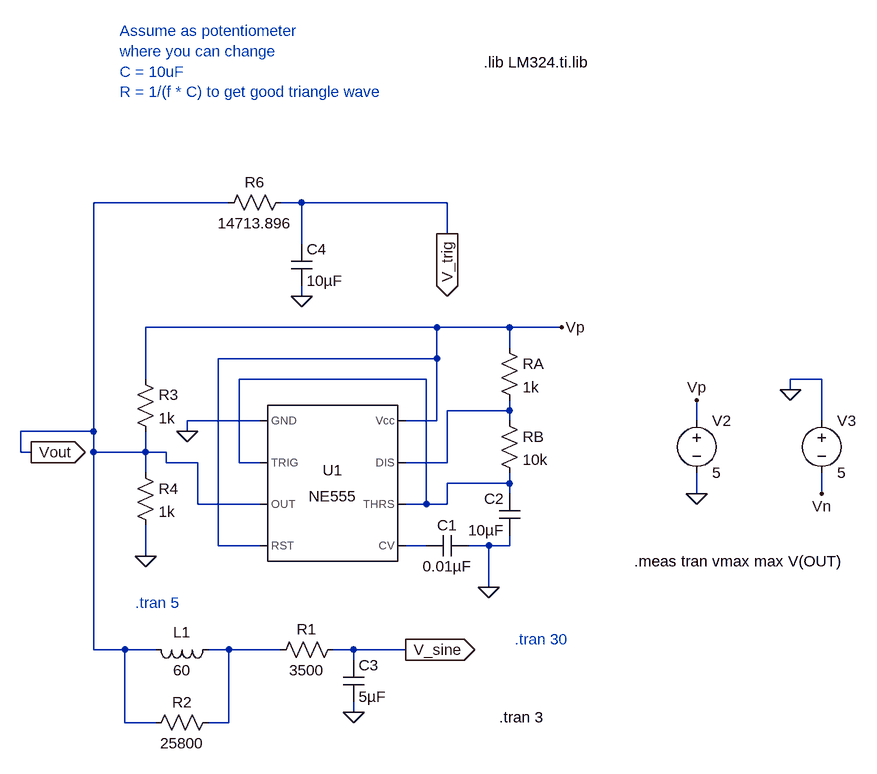
[diagram p0: schematic 555timer.asc]
555timer.asc, the LTspice schematic file:
Version 4.1
SHEET 1 2184 784
WIRE 64 -256 -144 -256
WIRE 176 -256 144 -256
WIRE 400 -256 176 -256
WIRE 400 -208 400 -256
WIRE 176 -192 176 -256
WIRE 176 -112 176 -128
WIRE 384 -64 -64 -64
WIRE 496 -64 384 -64
WIRE 576 -64 496 -64
WIRE 496 -32 496 -64
WIRE 384 -16 384 -64
WIRE 384 -16 48 -16
WIRE -64 16 -64 -64
WIRE 368 16 80 16
WIRE 976 16 928 16
WIRE 928 32 928 16
WIRE 496 64 496 48
WIRE 496 64 400 64
WIRE 112 80 0 80
WIRE 384 80 384 -16
WIRE 384 80 336 80
WIRE 496 80 496 64
WIRE 784 80 784 48
WIRE 976 80 976 16
WIRE -144 96 -144 -256
WIRE -144 96 -256 96
WIRE 0 96 0 80
WIRE -256 128 -256 96
WIRE -240 128 -256 128
WIRE -144 128 -144 96
WIRE -64 128 -64 96
WIRE -64 128 -144 128
WIRE -32 128 -64 128
WIRE -32 144 -32 128
WIRE 16 144 -32 144
WIRE 80 144 80 16
WIRE 112 144 80 144
WIRE 400 144 400 64
WIRE 400 144 336 144
WIRE -64 160 -64 128
WIRE 496 176 496 160
WIRE 496 176 400 176
WIRE 496 192 496 176
WIRE 784 192 784 160
WIRE 976 192 976 160
WIRE 16 208 16 144
WIRE 112 208 16 208
WIRE 368 208 368 16
WIRE 368 208 336 208
WIRE 400 208 400 176
WIRE 400 208 368 208
WIRE 48 272 48 -16
WIRE 112 272 48 272
WIRE 368 272 336 272
WIRE 464 272 432 272
WIRE 496 272 496 256
WIRE 496 272 464 272
WIRE -64 288 -64 240
WIRE 464 336 464 272
WIRE -144 432 -144 128
WIRE -96 432 -144 432
WIRE -48 432 -96 432
WIRE 64 432 32 432
WIRE 144 432 64 432
WIRE 256 432 224 432
WIRE 336 432 256 432
WIRE 256 448 256 432
WIRE 256 528 256 512
WIRE -96 544 -96 432
WIRE -48 544 -96 544
WIRE 64 544 64 432
WIRE 64 544 32 544
FLAG 0 96 0
FLAG 464 336 0
FLAG -64 288 0
FLAG -240 128 Vout
IOPIN -240 128 Out
FLAG 176 -112 0
FLAG 784 192 0
FLAG 784 48 Vp
FLAG 976 192 Vn
FLAG 928 32 0
FLAG 576 -64 Vp
FLAG 400 -208 V_trig
IOPIN 400 -208 Out
FLAG 256 528 0
FLAG 336 432 V_sine
IOPIN 336 432 Out
SYMBOL Misc\\NE555 224 176 R0
SYMATTR InstName U1
SYMBOL cap 432 256 R90
WINDOW 0 0 32 VBottom 2
WINDOW 3 32 32 VTop 2
SYMATTR InstName C1
SYMATTR Value 0.01µF
SYMBOL cap 512 256 R180
WINDOW 0 24 56 Left 2
WINDOW 3 24 8 Left 2
SYMATTR InstName C2
SYMATTR Value 10µF
SYMBOL res 480 64 R0
SYMATTR InstName RB
SYMATTR Value 10k
SYMBOL res 480 -48 R0
SYMATTR InstName RA
SYMATTR Value 1k
SYMBOL res -80 0 R0
SYMATTR InstName R3
SYMATTR Value 1k
SYMBOL res -80 144 R0
SYMATTR InstName R4
SYMATTR Value 1k
SYMBOL res 160 -272 R90
WINDOW 0 0 56 VBottom 2
WINDOW 3 32 56 VTop 2
SYMATTR InstName R6
SYMATTR Value 14713.896
SYMBOL cap 160 -192 R0
SYMATTR InstName C4
SYMATTR Value 10µF
SYMBOL voltage 784 64 R0
WINDOW 123 0 0 Left 0
WINDOW 39 0 0 Left 0
SYMATTR InstName V2
SYMATTR Value 5
SYMBOL voltage 976 64 R0
WINDOW 123 0 0 Left 0
WINDOW 39 0 0 Left 0
SYMATTR InstName V3
SYMATTR Value 5
SYMBOL ind 48 416 R90
WINDOW 0 5 56 VBottom 2
WINDOW 3 32 56 VTop 2
SYMATTR InstName L1
SYMATTR Value 60
SYMBOL cap 240 448 R0
SYMATTR InstName C3
SYMATTR Value 5µF
SYMBOL res 240 416 R90
WINDOW 0 0 56 VBottom 2
WINDOW 3 32 56 VTop 2
SYMATTR InstName R1
SYMATTR Value 3500
SYMBOL res 48 528 R90
WINDOW 0 0 56 VBottom 2
WINDOW 3 32 56 VTop 2
SYMATTR InstName R2
SYMATTR Value 25800
TEXT -80 360 Left 2 ;.tran 5
TEXT 688 296 Left 2 !.meas tran vmax max V(OUT)
TEXT -104 -520 Left 2 ;Assume as potentiometer \nwhere you can change\nC = 10uF\nR = 1/(f * C) to get good triangle wave
TEXT 456 -472 Left 2 !.lib LM324.ti.lib
TEXT 504 416 Left 2 ;.tran 30
TEXT 480 536 Left 2 !.tran 3

The netlist it stands for:
* 555timer.asc
X§U1 0 N001 Vout Vp N003 N001 N002 Vp NE555  ; pins GND TRIG OUT RST CV THRS DIS Vcc
C1 0 N003 0.01µF
C2 0 N001 10µF
RB N002 N001 10k
RA Vp N002 1k
R3 Vp Vout 1k
R4 Vout 0 1k
R6 V_trig Vout 14713.896
C4 V_trig 0 10µF
V2 Vp 0 5
V3 0 Vn 5
L1 N004 Vout 60
C3 V_sine 0 5µF
R1 V_sine N004 3500
R2 N004 Vout 25800
* .tran 5
.meas tran vmax max V(OUT)
* Assume as potentiometer
* where you can change
* C = 10uF
* R = 1/(f * C) to get good triangle wave
.lib LM324.ti.lib
* .tran 30
.tran 3
.lib NE555.sub
.backanno
.end